# Altium schematic sheet Virtual_Ground.SchDoc
size A4
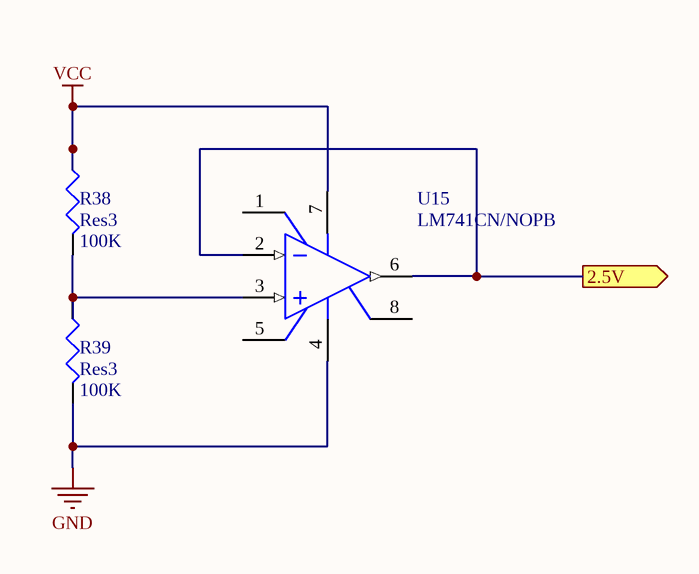
[diagram p0: Virtual_Ground.SchDoc]

## Parts
R38  Res3  value 100K  [J1-0603]
R39  Res3  value 100K  [J1-0603]
U15  LM741CN/NOPB  [P0008A]

## Ports
2.5V (out)

## Nets
GND: R39.1 U15.4(V-)
VCC: R38.2 U15.7(V+)
2.5V: U15.2(IN-) U15.6(OUT) ; port 2.5V
NetR38_1: R38.1 R39.2 U15.3(IN+)

Not connected (* = marked no-connect by the designer): U15 1(OFS_NULL) 5(OFS_NULL) 8(NC)

## Library data of the parts
R38 R39 = Res3: Resistor; Published: 8-Jun-2000; LatestRevisionDate: 29-May-2009; LatestRevisionNote: IPC-7351 Footprint Added.; PackageReference: J1-0603; Publisher: Altium Limited; PackageDescription: Chip Resistor
U15 = CMP-0055-00162-3: Operational Amplifier, 8-pin MDIP, Pb-Free; Manufacturer: Texas Instruments; PackageTopMarking: NSUZXYTTE#*LM*741CN; PowerWise: N; CompType: Amplifiers; ComponentLink1Description: Datasheet URL; ComponentLink1URL: http://www.ti.com/general/docs/lit/getliterature.tsp?genericPartNumber=LM741&fileType=pdf; PackageDescription: MDIP, .365 x .250 x .130in, 8 Lead, .100in Pitch; RoHS: Y; PinCount: 8; Code_JEDEC: MS-001-BA; Package Reference: P0008A